# Altium project Forward_Project.PrjPcb
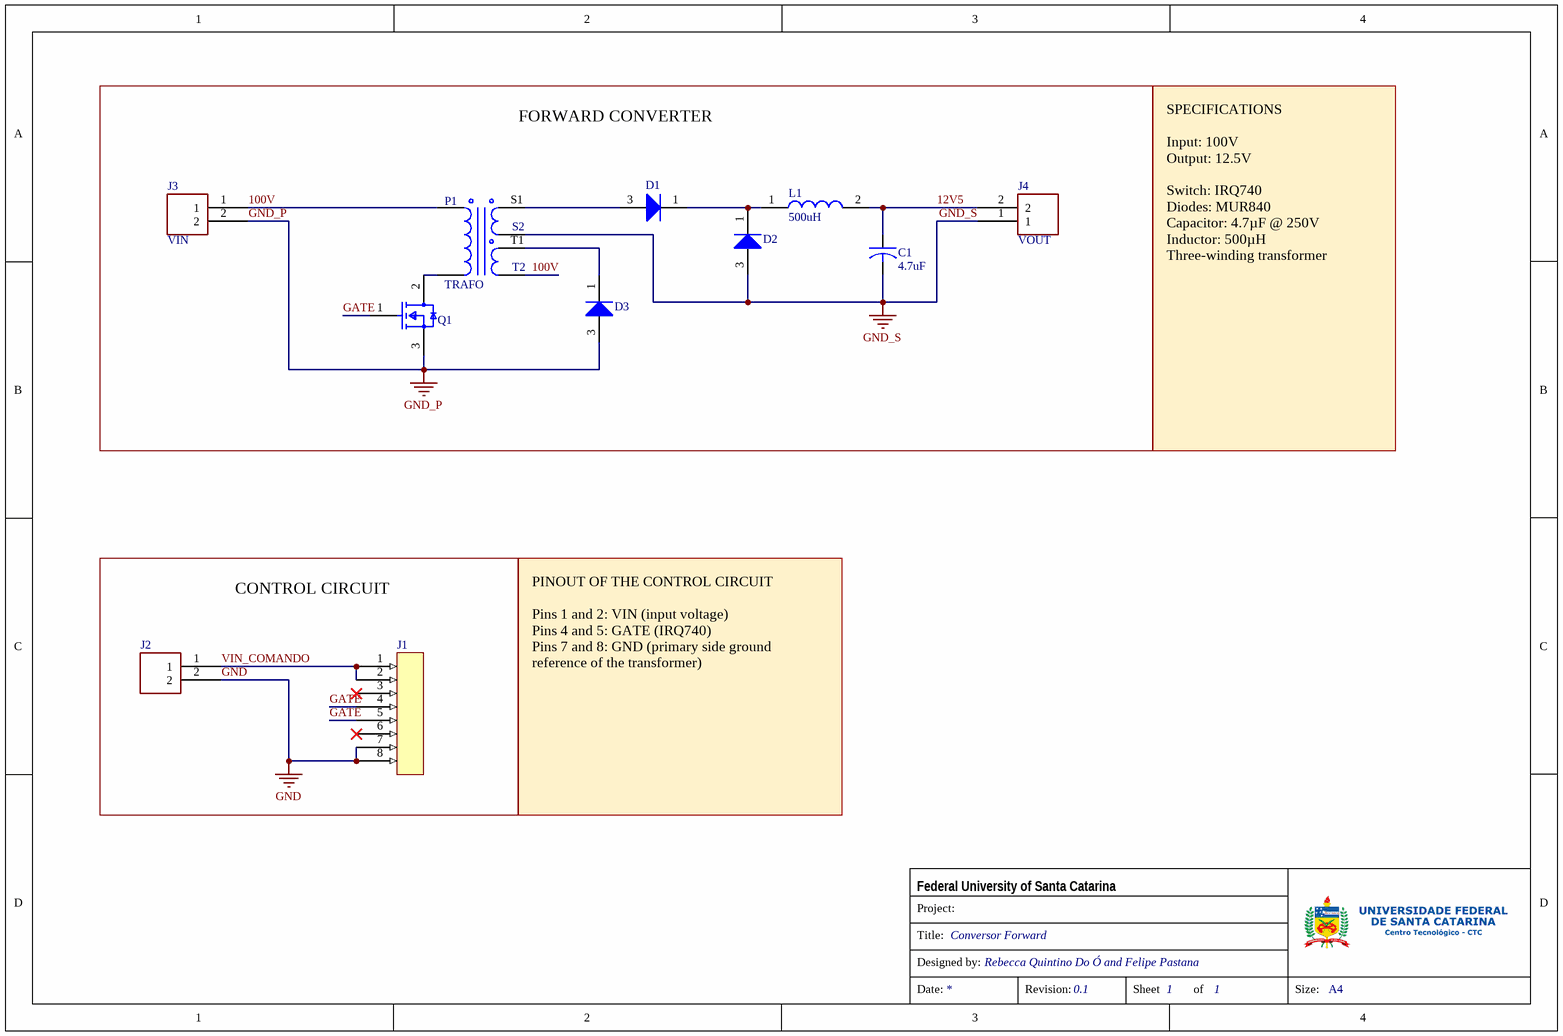
[diagram p0: Forward.SchDoc]
Author: Rebecca Quintino Do Ó e Felipe Pastana; CheckedBy: Prof. Telles Brunneli Lazzarin D. Eng.; Revision: 0.1; Title: Conversor Forward
1 sheet, 11 parts. Net scope: global (net labels, ports and power ports of the same name join across sheets).
Board file: Forward.PcbDoc

## Sheet Forward.SchDoc: Conversor Forward
size A4; DesignedBy: Rebecca Quintino Do Ó and Felipe Pastana; SheetNumber: 1; SheetTotal: 1; Organization: UFSC; Revision: 0.1; Sheet Number: 1; Sheet Total: 1

### Parts
C1  4.7uF  [Capacitor]
D1  MUR840G  [MUR840]  (value not drawn)
D2  MUR840G  [MUR840]  (value not drawn)
D3  MUR840G  [MUR840]  (value not drawn)
J1  header 8pin  [Header 8pin]  (value not drawn)
J2  Con_Molex_2_pin  [CON_MOLEX_2_vias]  (value not drawn)
J3  VIN  [Borne_KRE_2pin]
J4  VOUT  [Borne_KRE_2pin]
L1  500uH  [Indutor]
Q1  IRF740  [IRF430]  (value not drawn)
TRAFO  Three-winding transformer  [Trafo_NEE_30/14]  (value not drawn)

### Blocks framed on the sheet
FORWARD CONVERTER: C1 D1-D3 J3 J4 L1 Q1 TRAFO
CONTROL CIRCUIT: J1 J2

### Nets
GND: J1.7 J1.8 J2.2
GND_P: D3.3(A) J3.2 Q1.3(S)
GND_S: C1.2 D2.3(A) J4.1 TRAFO.S2
12V5: C1.1 J4.2 L1.2
100V: J3.1 TRAFO.P1 TRAFO.S2
GATE: J1.4 J1.5 Q1.1(G)
VIN_COMANDO: J1.1 J1.2 J2.1
NetD1_1: D1.1(K) D2.1(K) L1.1
NetD1_3: D1.3(A) TRAFO.S1
NetD3_1: D3.1(K) TRAFO.T1
NetQ1_2: Q1.2(D) TRAFO.P2(gg)

Not connected (* = marked no-connect by the designer): J1 3* 6*

### Notes on the sheet
- SPECIFICATIONS
  Input: 100V
  Output: 12.5V
  Switch: IRQ740
  Diodes: MUR840
  Capacitor: 4.7µF @ 250V
  Inductor: 500µH
  Three-winding transformer
- PINOUT OF THE CONTROL CIRCUIT
  Pins 1 and 2: VIN (input voltage)
  Pins 4 and 5: GATE (IRQ740)
  Pins 7 and 8: GND (primary side ground reference of the transformer)
- Project:
- Federal University of Santa Catarina
- Title:
- Designed by:
- Date:
- Revision:
- Sheet
- of
- Size:
- A4
- (in symbol Trafo) T2

### Library data of the parts
C1 = Capacitor Eletro: Electrolytic capacitor
D1-D3 = mur840: DIODE STANDARD 400V 8A TO2202
J2 = Con_Molex_2_pin: Connector KK Male 180° 2 Pins
J3 J4 = Borne_KRE_2_vias: Connector Borne KRE 2 Vias
L1 = Indutor: Indutor manufacture handmade
Q1 = IRF740: MOSFET N-CH 400V 10A TO220AB
TRAFO = Trafo: Handmade three-winding transformer